# Altium schematic sheet 5V_Regulator.SchDoc
size A4
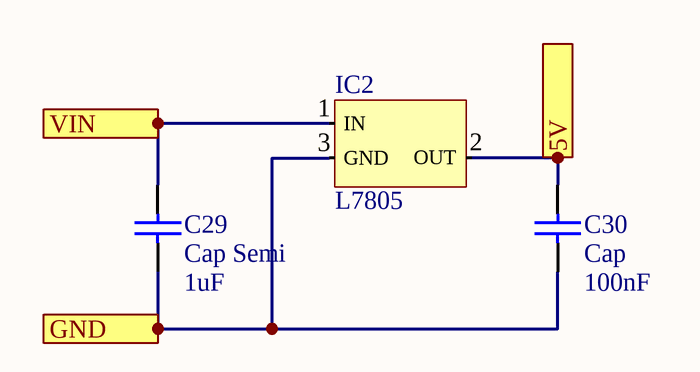
[diagram p0: 5V_Regulator.SchDoc]

## Parts
C29  Cap Semi  value 1uF  [0402]
C30  Cap  value 100nF  [0402]
IC2  L7805  [D2PAK]

## Ports
5V (out), GND (out), VIN (in)

## Nets
5V: C30.2 IC2.2(OUT) ; port 5V
GND: C29.1 C30.1 IC2.3(GND) ; port GND
VIN: C29.2 IC2.1(IN) ; port VIN

## Library data of the parts
C29 = Cap Semi: Multilayer Ceramic Capacitors MLCC - SMD/SMT CGB 0402 16V 1uF JB 20%; Mfr. No: CGB2A1JB1C105M033BC; PackageReference: SMD-0402(1005 metric); PackageDescription: Chip Capacitor; Mouser No: 810-CGB2A1JB1C105M0C
C30 = Cap: Multilayer Ceramic Capacitors MLCC - SMD/SMT 16volts 0.1uF 20% X7R; Mfr. No: C0402C104M4RACAUTO; PackageReference: SMD-0402 (1005 metric); PackageDescription: Ceramic Capacitor; Mouser No: 80-C0402C104M4RAUTO
IC2 = L7805ACD2T-TR: Linear Voltage Regulators 5.0V 1.0A Positive; Mfr. No: L7805CD2T-TR; Mouser No: 511-L7805CD2T-TR